# EAGLE design 5x4-soundboard_arduino_pro_mini (EAGLE 8.1.0)
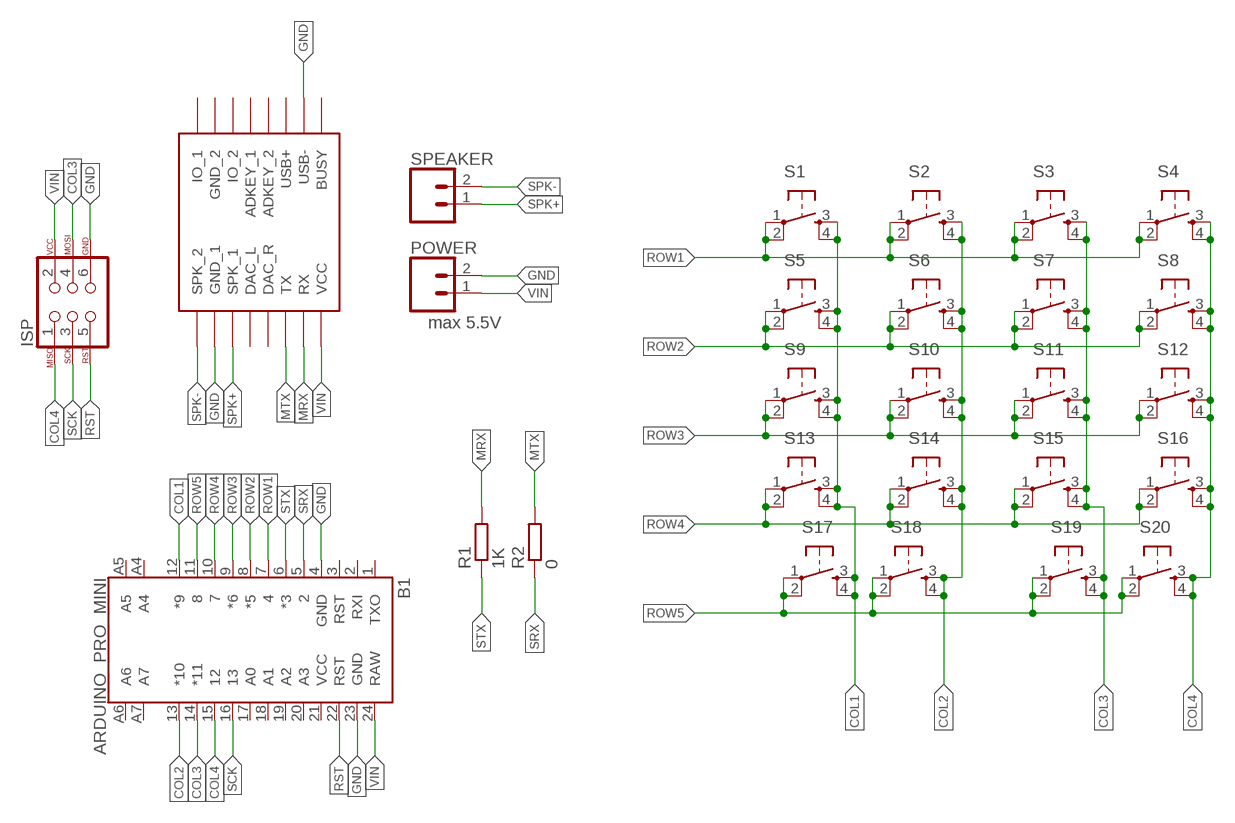
[diagram p0: schematic, sheet 1]

## Parts
B1  ARDUINO_PRO_MINI  [ARDUINO_PRO_MINI]
ISP  AVR_SPI_PROG_3X2PTH  [2X3]
POWER  CONN_02LOCK_LONGPADS  [1X02_LOCK_LONGPADS]
R1  1K  R-EU_0207/10  [0207/10]
R2  0  R-EU_0207/10  [0207/10]
S1  TAC_SWITCHPTH  [TACTILE-PTH]
S2  TAC_SWITCHPTH  [TACTILE-PTH]
S3  TAC_SWITCHPTH  [TACTILE-PTH]
S4  TAC_SWITCHPTH  [TACTILE-PTH]
S5  TAC_SWITCHPTH  [TACTILE-PTH]
S6  TAC_SWITCHPTH  [TACTILE-PTH]
S7  TAC_SWITCHPTH  [TACTILE-PTH]
S8  TAC_SWITCHPTH  [TACTILE-PTH]
S9  TAC_SWITCHPTH  [TACTILE-PTH]
S10  TAC_SWITCHPTH  [TACTILE-PTH]
S11  TAC_SWITCHPTH  [TACTILE-PTH]
S12  TAC_SWITCHPTH  [TACTILE-PTH]
S13  TAC_SWITCHPTH  [TACTILE-PTH]
S14  TAC_SWITCHPTH  [TACTILE-PTH]
S15  TAC_SWITCHPTH  [TACTILE-PTH]
S16  TAC_SWITCHPTH  [TACTILE-PTH]
S17  TAC_SWITCHPTH  [TACTILE-PTH]
S18  TAC_SWITCHPTH  [TACTILE-PTH]
S19  TAC_SWITCHPTH  [TACTILE-PTH]
S20  TAC_SWITCHPTH  [TACTILE-PTH]
SPEAKER  CONN_02LOCK_LONGPADS  [1X02_LOCK_LONGPADS]
U$1  DFPLAYER  [DFPLAYER]

## Nets
COL1: B1.12(*9) S1.3 S1.4 S5.3 S5.4 S9.3 S9.4 S13.3 S13.4 S17.3 S17.4
COL2: B1.13(*10) S2.3 S2.4 S6.3 S6.4 S10.3 S10.4 S14.3 S14.4 S18.3 S18.4
COL3: B1.14(*11) ISP.4 S3.3 S3.4 S7.3 S7.4 S11.3 S11.4 S15.3 S15.4 S19.3 S19.4
COL4: B1.15 ISP.1 S4.3 S4.4 S8.3 S8.4 S12.3 S12.4 S16.3 S16.4 S20.3 S20.4
GND: B1.4(GND) B1.23(GND) ISP.6 POWER.2 U$1.GND_1 U$1.USB-
MRX: R1.2 U$1.RX
MTX: R2.2 U$1.TX
ROW1: B1.7 S1.1 S1.2 S2.1 S2.2 S3.1 S3.2 S4.1 S4.2
ROW2: B1.8(*5) S5.1 S5.2 S6.1 S6.2 S7.1 S7.2 S8.1 S8.2
ROW3: B1.9(*6) S9.1 S9.2 S10.1 S10.2 S11.1 S11.2 S12.1 S12.2
ROW4: B1.10 S13.1 S13.2 S14.1 S14.2 S15.1 S15.2 S16.1 S16.2
ROW5: B1.11 S17.1 S17.2 S18.1 S18.2 S19.1 S19.2 S20.1 S20.2
RST: B1.22(RST) ISP.5
SCK: B1.16 ISP.3
SPK+: SPEAKER.1 U$1.SPK1(SPK_1)
SPK-: SPEAKER.2 U$1.SPK2(SPK_2)
SRX: B1.5 R2.1
STX: B1.6(*3) R1.1
VIN: B1.24(RAW) ISP.2 POWER.1 U$1.VCC
Unconnected: B1.1(TXO) B1.2(RXI) B1.3(RST) B1.17(A0) B1.18(A1) B1.19(A2) B1.20(A3) B1.A4 B1.A5 B1.A6 B1.A7 U$1.ADKEY1(ADKEY_1) U$1.ADKEY2(ADKEY_2) U$1.BUSY U$1.DAC_L U$1.DAC_R U$1.GND_2 U$1.IO1(IO_1) U$1.IO2(IO_2) U$1.USB+

## Notes on the sheet
- max 5.5V

## Power pins joined to a net without a drawn wire
VCC: B1.21(VCC)

## Library data of the parts
B1 = SparkFun-Boards_fixed_pro_mini:ARDUINO_PRO_MINI: SparkFun Pro Mini Pro Mini compatible footprint. Dimensions: 0.7 x 1.3" PCB Thickness: 0.8mm SparkFun Products: 3.3V/8MHz <https://www.sparkfun.com/products/11114> 5V/16MHz <https://www.sparkfun.com/products/11113>
ISP = SparkFun-Connectors:AVR_SPI_PROG_3X2: AVR ISP 6 Pin This is the reduced ISP connector for AVR programming. Common on Arduino. This footprint will take up less PCB space and can be used with a 10-pin to 6-pin adapter such as SKU: BOB-08508 **Special note about "TEST_POINT" package. The stop mask is on the top side, so if you want your programming test points to be on the bottom of your board, make sure to place this package on the bottom side of the board. This also ensure that the orientation to program from the bottom side will be correct. SparkFun Products: SparkFun ISP Pogo Adapter <https://www.sparkfun.com/products/11591> - NS Tiny AVR Programmer <https://www.sparkfun.com/products/11801> -PTH
POWER SPEAKER = SparkFun-Connectors:CONN_02: Multi connection point. Often used as Generic Header-pin footprint for 0.1 inch spaced/style header connections On any of the 0.1 inch spaced packages, you can populate with these: Break Away Headers - Straight <https://www.sparkfun.com/products/116> (PRT-00116) Break Away Male Headers - Right Angle <https://www.sparkfun.com/products/553> (PRT-00553) Female Headers <https://www.sparkfun.com/products/115> (PRT-00115) Break Away Headers - Machine Pin <https://www.sparkfun.com/products/117> (PRT-00117) Break Away Female Headers - Swiss Machine Pin <https://www.sparkfun.com/products/743> (PRT-00743) For SCREWTERMINALS and SPRING TERMINALS visit here: Screw Terimnals on SparkFun.com <https://www.sparkfun.com/search/results?term=Screw+Terminals> (5mm/3.5mm/2.54mm spacing) This device is also useful as a general connection point to wire up your design to another part of your project. Our various solder wires solder well into these plated through hole pads. Hook-Up Wire - Assortment (Stranded, 22 AWG) <https://www.sparkfun.com/products/11375> (PRT-11375) Hook-Up Wire - Assortment (Solid Core, 22 AWG) <https://www.sparkfun.com/products/11367> (PRT-11367) View the entire wire category on our website here <https://www.sparkfun.com/categories/141> Special notes: Molex polarized connector foot print use with: PRT-08233 with associated crimp pins and housings. 2.54_SCREWTERM for use with PRT-10571. 3.5mm Screw Terminal footprints for PRT-08084 5mm Screw Terminal footprints for use with PRT-08432
R1 R2 = resistor:R-EU_: RESISTOR, European symbol
S1-S20 = SparkFun-Retired:TAC_SWITCH: Momentary Switch Button commonly used for reset or general input. Spark Fun Electronics SKU : COM-00097 SMT- SWCH-08247
U$1 = DFPlayer_v1:DFPLAYER

## Board
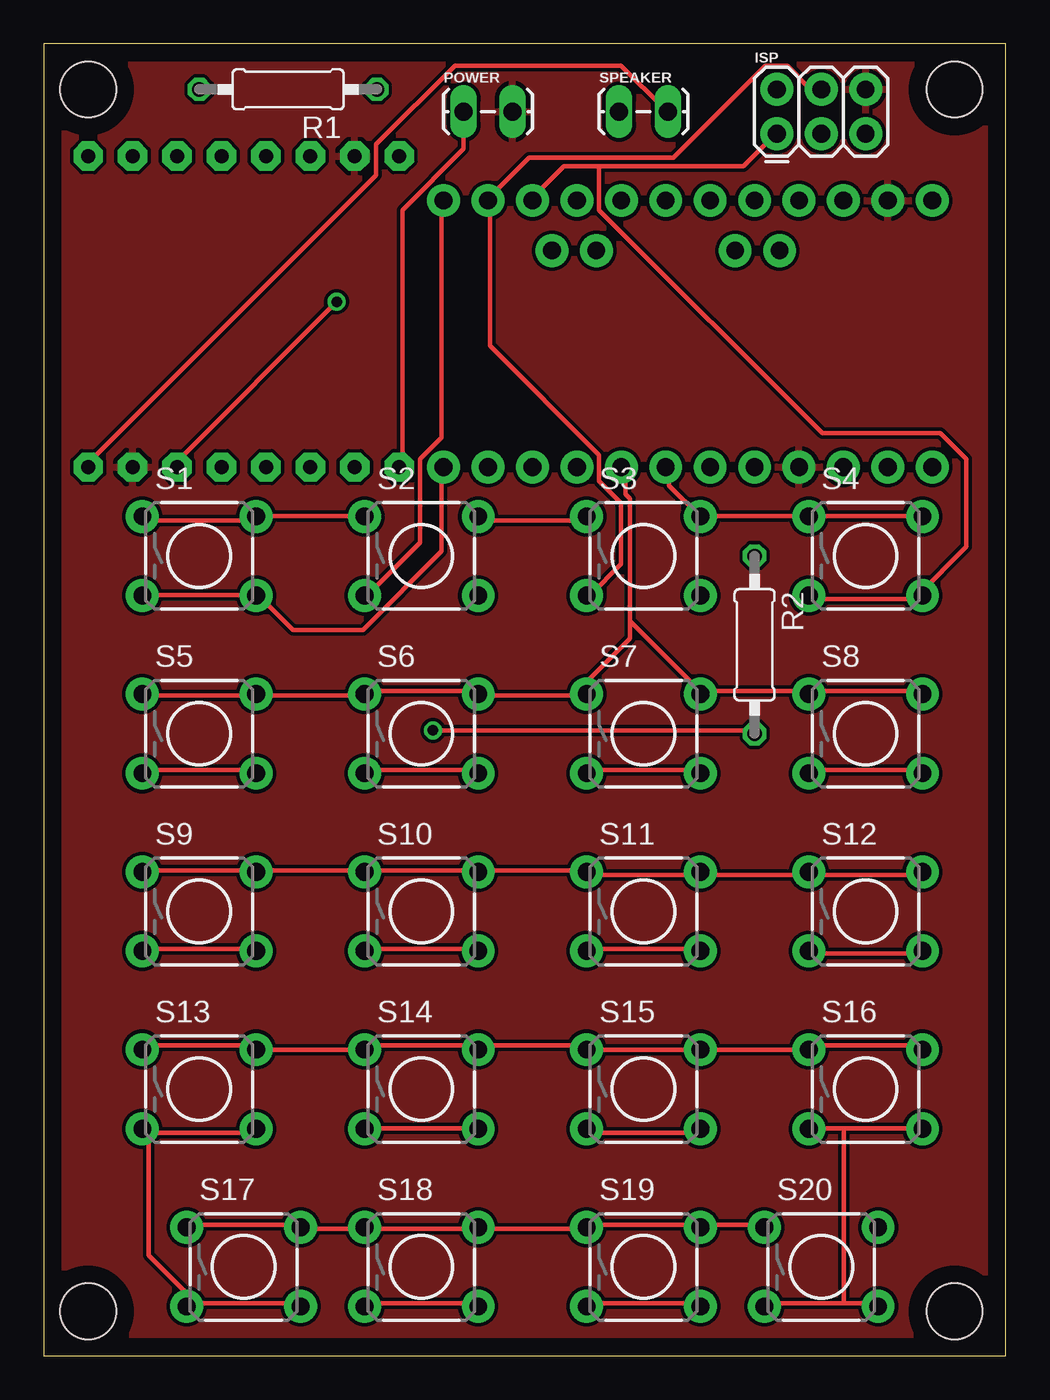
[diagram p1: board, top side]
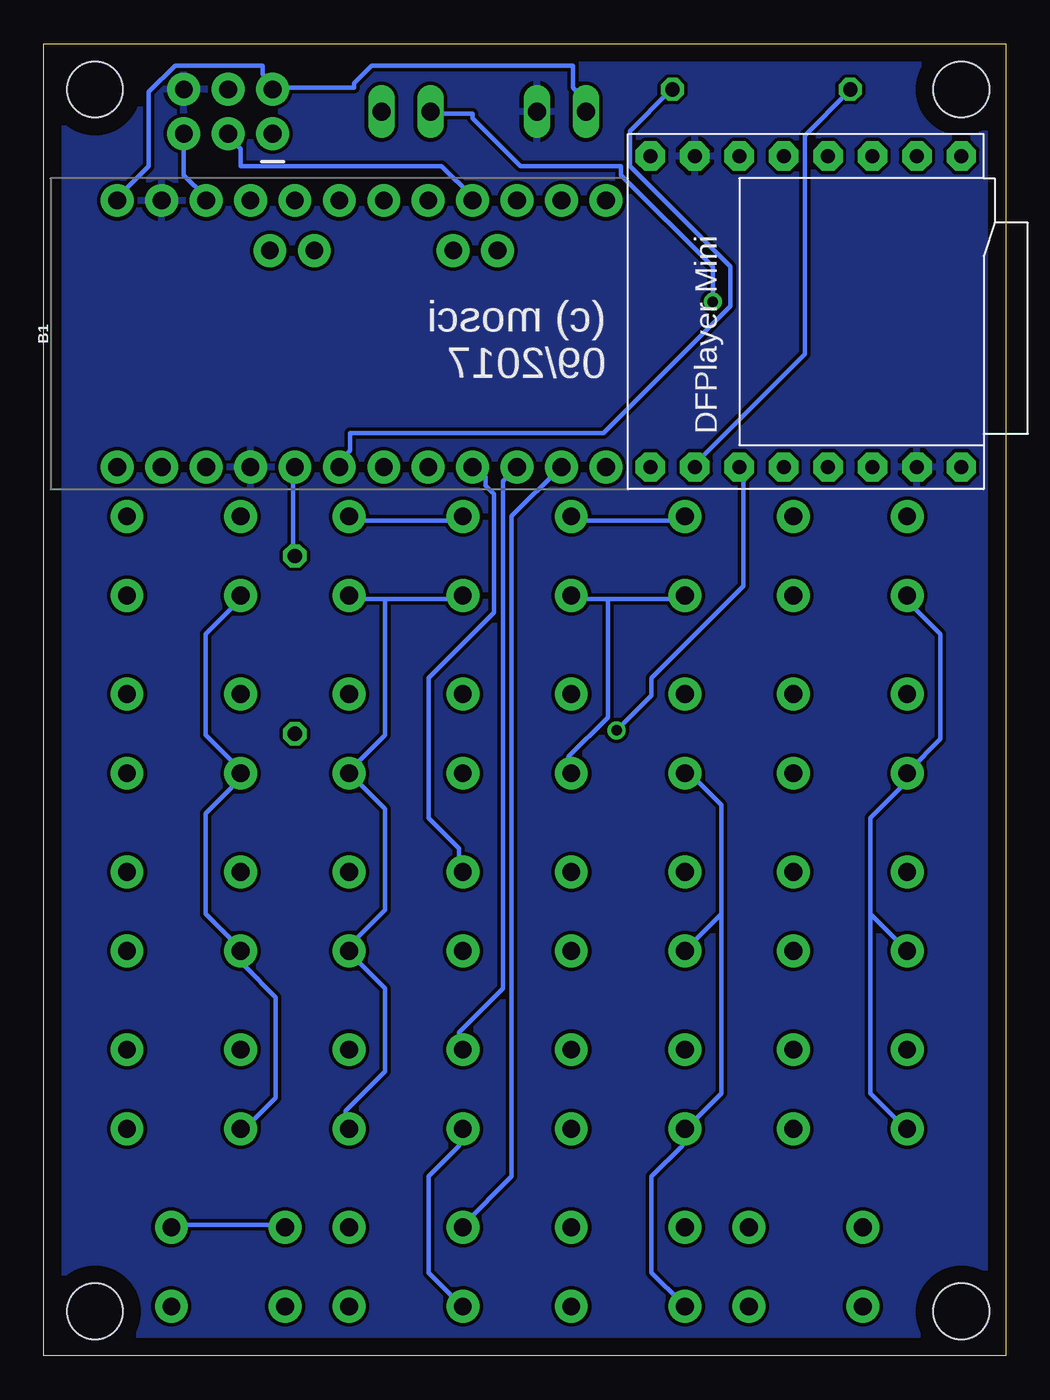
[diagram p2: board, bottom side, seen from below]

Size 55 x 75 mm. Coordinates in mm from the lower left corner, seen from the top.
Outline: 0,0 55,0 55,75 0,75 0,0
Copper layers (1*16): Top 0.035mm / dielectric 1.5mm / Bottom 0.035mm
Design rules "default": minimum track width 10mil, minimum drill 24mil, track to track 8mil, track to pad 8mil, pad to pad 8mil, via to via 8mil, smd to smd 8mil, copper to edge 40mil, drill to drill 8mil, minimum pad ring 10mil, minimum via ring 8mil, stop-mask expansion 4mil, vias tented up to drill 0mil, thermal gap 10mil
Holes 3.2 mm at 2.54,72.39 52.07,72.39 2.54,2.54 52.07,2.54

### Footprints (pad centres in the part's own frame; a part is rotated, then mirrored left to right if it is on the bottom)
ARDUINO_PRO_MINI = drill 1.016 pad 1.88: 1 -7.62,12.7; 2 -7.62,10.16; 3 -7.62,7.62; 4 -7.62,5.08; 5 -7.62,2.54; 6 -7.62,0; 7 -7.62,-2.54; 8 -7.62,-5.08; 9 -7.62,-7.62; 10 -7.62,-10.16; 11 -7.62,-12.7; 12 -7.62,-15.24; 13 7.62,-15.24; 14 7.62,-12.7; 15 7.62,-10.16; 16 7.62,-7.62; 17 7.62,-5.08; 18 7.62,-2.54; 19 7.62,0; 20 7.62,2.54; 21 7.62,5.08; 22 7.62,7.62; 23 7.62,10.16; 24 7.62,12.7; A4 4.763,1.429; A5 4.763,3.969; A6 4.763,-9.049; A7 4.763,-6.509
2X3 = drill 1.016 pad 1.88: 1 0,0; 2 0,2.54; 3 2.54,0; 4 2.54,2.54; 5 5.08,0; 6 5.08,2.54
1X02_LOCK_LONGPADS = drill 1.016 long: 1 -0.127,0; 2 2.667,0
0207/10 = drill 0.813 octagon: 1 -5.08,0; 2 5.08,0
TACTILE-PTH = drill 1.016 pad 1.88: 1 -3.251,2.261; 2 3.251,2.261; 3 -3.251,-2.261; 4 3.251,-2.261
DFPLAYER = drill 0.8 pad 1.676 octagon: ADKEY1 8.89,-1.27; ADKEY2 8.89,1.27; BUSY 8.89,8.89; DAC_L -8.89,-1.27; DAC_R -8.89,1.27; GND_1 -8.89,-6.35; GND_2 8.89,-6.35; IO1 8.89,-8.89; IO2 8.89,-3.81; RX -8.89,6.35; SPK1 -8.89,-3.81; SPK2 -8.89,-8.89; TX -8.89,3.81; USB+ 8.89,3.81; USB- 8.89,6.35; VCC -8.89,8.89

### Placement (x,y rotation side)
B1  38.1,58.42 90 bottom
ISP  41.91,69.85 0 top
POWER  24.13,71.12 0 top
R1  13.97,72.39 180 top
R2  40.64,40.64 270 top
S1  8.89,45.72 0 top
S2  21.59,45.72 0 top
S3  34.29,45.72 0 top
S4  46.99,45.72 0 top
S5  8.89,35.56 0 top
S6  21.59,35.56 0 top
S7  34.29,35.56 0 top
S8  46.99,35.56 0 top
S9  8.89,25.4 0 top
S10  21.59,25.4 0 top
S11  34.29,25.4 0 top
S12  46.99,25.4 0 top
S13  8.89,15.24 0 top
S14  21.59,15.24 0 top
S15  34.29,15.24 0 top
S16  46.99,15.24 0 top
S17  11.43,5.08 0 top
S18  21.59,5.08 0 top
S19  34.29,5.08 0 top
S20  44.45,5.08 0 top
SPEAKER  33.02,71.12 0 top
U$1  11.43,59.69 90 bottom

### Tracks (layer width: path | path; a pad name or v marks a point on that pad's centre or on a via)
COL1
  Top 0.254: 6,12.75 12,12.75 S13.4 | 6,12.75 5.75,12.75 S13.3 6,12.75 | 8.75,3 14.5,3 S17.4 | 8.75,3 8.25,3 S17.3 8.75,3 | 6,12.75 6,5.75 8.75,3 | S9.3 5.75,23.25 12,23.25 S9.4 | S5.3 5.75,33.5 12,33.5 S5.4 | S1.3 5.75,43.5 12,43.5 S1.4 12.25,43.5 14.25,41.5 18.25,41.5 22.75,46 22.75,50.75 B1.12
  Bottom 0.254: 7.75,25.25 5.75,23.25 S9.3 | 7.75,25.25 7.75,30.75 5.75,32.75 5.75,33.25 S5.3 5.5,33.5 3.75,35.25 3.75,41.25 5.5,43 5.5,43.25 S1.3 | 7.75,25.25 7.75,15 5.75,13 S13.3
COL2
  Top 0.254: B1.13 22.75,66 22.75,52.5 21.5,51.25 21.5,46.5 18.5,43.5 S2.3 | S18.3 18.5,3 24.75,3 S18.4 | S14.3 18.5,13 24.75,13 S14.4 | S10.3 18.5,23.25 24.75,23.25 S10.4 | S6.3 18.5,33.5 24.75,33.5 S6.4
  Bottom 0.254: 22.75,43.25 24.75,43.25 S2.4 | 22.75,43.25 18.5,43.25 S2.3 | S18.3 18.5,3 20.25,4.75 20.25,10.25 18.5,12 18.5,12.75 S14.3 18.25,13 16.25,15 16.25,25.25 | 16.25,25.25 18.25,23.25 S10.3 | 16.25,25.25 16.25,31.5 18.25,33.5 S6.3 | 22.75,43.25 22.75,36.5 25,34.25 25,33.5 S6.4
COL3
  Top 0.254: ISP.4 44.25,72.5 43.75,72.5 42.5,73.75 41.25,73.75 36,68.5 27.75,68.5 25.5,66.25 B1.14 25.5,66 25.5,57.75 31.75,51.5 31.75,50 33,48.75 33,45.25 31.25,43.5 S3.3 | S7.3 31.25,33.5 37.5,33.5 S7.4 | S11.3 31.25,23.25 37.5,23.25 S11.4 | S19.3 31.25,3 37.5,3 S19.4 | S15.3 31.25,12.75 37.5,12.75 S15.4
  Bottom 0.254: 35.5,43.25 37.5,43.25 S3.4 | 35.5,43.25 31.25,43.25 S3.3 | 35.5,43.25 35.5,35.5 37.5,33.5 S7.4 37.5,33.25 35.5,31.25 35.5,25.5 37.5,23.5 37.5,23.25 S11.4 37.5,23 35.5,21 35.5,16.25 37.75,14 37.75,13 S15.4 | S19.3 31.25,3 33,4.75 33,10.25 31.25,12 31.25,12.75 S15.3
COL4
  Top 0.254: 45.75,3 47.5,3 S20.4 | 45.75,3 41.25,3 S20.3 | 45.75,13 50,13 S16.4 | 45.75,13 43.75,13 S16.3 | 45.75,13 45.75,3 | 31.75,68 40,68 41.75,69.75 ISP.1 | 31.75,68 29.75,68 28,66.25 B1.15 | S4.3 43.75,43.25 50,43.25 S4.4 50,43.5 52.75,46.25 52.75,51.25 51.25,52.75 44.5,52.75 31.75,65.5 31.75,68 | S12.3 43.75,23 50,23 S12.4 | S8.3 43.75,33.5 50,33.5 S8.4
  Bottom 0.254: S4.3 43.75,43.25 45.75,41.25 45.75,35.5 43.75,33.5 S8.3 43.75,33.25 43.75,33 45.75,31 45.75,25.25 43.75,23.25 S12.3 43.5,23 43.5,22.25 41.75,20.5 41.75,14.75 43.5,13 S16.3
GND
  pour Top: -13.97,88.9 78.74,88.9 78.74,-20.32 -13.97,-20.32
  pour Bottom: -7.62,85.09 69.85,85.09 69.85,83.82 69.85,-11.43 -7.62,-11.43
MRX
  Bottom 0.254: R1.2 9,72.25 11.5,69.75 11.5,57.25 17.75,51 U$1.RX
MTX  (via drill 0.61)
  Top 0.254: v22.25,35.75 40.5,35.75 R2.2
  Bottom 0.254: v22.25,35.75 20.25,37.75 20.25,38.75 15,44 15,50.75 U$1.TX
ROW1
  Top 0.254: S1.1 5.75,47.75 12,47.75 S1.2 12.25,48 18.25,48 S2.1 | S2.2 25,47.75 31,47.75 S3.1 | B1.7 35.75,50.75 35.75,49.75 37.5,48 S3.2 37.75,48 43.5,48 S4.1 43.75,48 50,48 S4.2
  Bottom 0.254: S3.1 31.25,47.75 37.5,47.75 S3.2 | S2.1 18.5,47.75 24.75,47.75 S2.2
ROW2
  Top 0.254: S5.1 5.75,37.75 12,37.75 S5.2 12.25,37.75 18.25,37.75 S6.1 18.5,38 24.75,38 S6.2 25,37.75 30.25,37.75 | 30.25,37.75 31,37.75 S7.1 30.25,37.75 | 33.5,42 33.5,41 30.25,37.75 | 33.5,42 33.5,49 33.25,49.25 33.25,50.75 B1.8 | 33.5,42 37.5,38 S7.2 37.75,38 43.5,38 S8.1 43.75,38 50,38 S8.2
ROW3
  Top 0.254: S9.1 5.75,27.75 12,27.75 S9.2 12.25,27.75 18.25,27.75 S10.1 18.5,27.75 24.75,27.75 S10.2 25,27.75 31,27.75 S11.1 31.25,27.5 37.5,27.5 S11.2 37.75,27.5 43.5,27.5 S12.1 43.75,27.5 50,27.5 S12.2
  Bottom 0.254: B1.9 30.25,50.75 29.75,50.25 29.75,49.75 29.25,49.25 29.25,42.5 33,38.75 33,30.75 31.25,29 31.25,27.75 S11.1
ROW4
  Top 0.254: S16.2 50,17.75 43.75,17.75 S16.1 43.5,17.5 37.75,17.5 S15.2 37.5,17.5 31.25,17.5 S15.1 31,17.75 25,17.75 S14.2 24.75,17.75 18.5,17.75 S14.1 18.25,17.5 12.25,17.5 S13.2 12,17.75 5.75,17.75 S13.1
  Bottom 0.254: B1.10 28,50.75 28.75,50 28.75,21 31.25,18.5 31.25,17.75 S15.1
ROW5
  Top 0.254: S20.1 41,7.5 37.75,7.5 S19.2 37.5,7.5 31.25,7.5 S19.1 31,7.25 25,7.25 S18.2 24.75,7.25 18.5,7.25 S18.1 18.25,7.25 14.75,7.25 S17.2 14.5,7.5 8.25,7.5 S17.1
  Bottom 0.254: S20.2 47.5,7.5 41.25,7.5 S20.1 | B1.11 25.5,50.75 28.25,48 28.25,10.25 31,7.5 S19.1
RST
  Bottom 0.254: B1.22 45.75,66.25 47,67.5 47,69.75 ISP.5
SCK
  Bottom 0.254: B1.16 30.5,66.25 32.25,68 43.75,68 43.75,69 44.25,69.5 44.25,69.75 ISP.3
SPK+  (via drill 0.61)
  Top 0.254: v16.75,60.25 7.5,51 U$1.SPK1
  Bottom 0.254: v16.75,60.25 16.75,62.25 22,67.5 22,68 27.75,68 30.5,70.75 30.5,71 32.75,71 SPEAKER.1
SPK-
  Top 0.254: SPEAKER.2 35.5,71.25 33,73.75 23.5,73.75 19,69.25 19,67.5 2.5,51 U$1.SPK2
SRX
  Bottom 0.254: R2.1 40.75,45.75 40.75,50.75 B1.5
STX
  Bottom 0.254: R1.1 19.25,72.25 21.5,70 21.5,68 15.75,62.25 15.75,60 23,52.75 37.5,52.75 37.5,51.75 38,51.25 38,51 B1.6
VIN
  Top 0.254: POWER.1 24,71 24,69 20.5,65.5 20.5,51 U$1.VCC
  Bottom 0.254: POWER.1 24.25,71.25 24.25,72 24.75,72.5 24.75,73.75 36.25,73.75 37.25,72.75 37.25,72.5 41.75,72.5 ISP.2 42,72.5 42,72.75 42.5,73.25 42.5,73.75 47.5,73.75 49,72.25 49,68 50.75,66.25 B1.24

### Text on the board
bNames: (c) mosci / 09/2017